# Altium project smoothieboard-alt.PrjPcb (part 2 of 4)

## Sheet smoothieboard-alt-p1.SchDoc: =ProjectTitle
size B; Organization: Altium Limited; Address1: L3, 12a Rodborough Rd; Address2: Frenchs Forest; Address3: NSW; Address4: Australia 2086; DocumentNumber: 2; Revision: 0.1; SheetNumber: 2; SheetTotal: 6
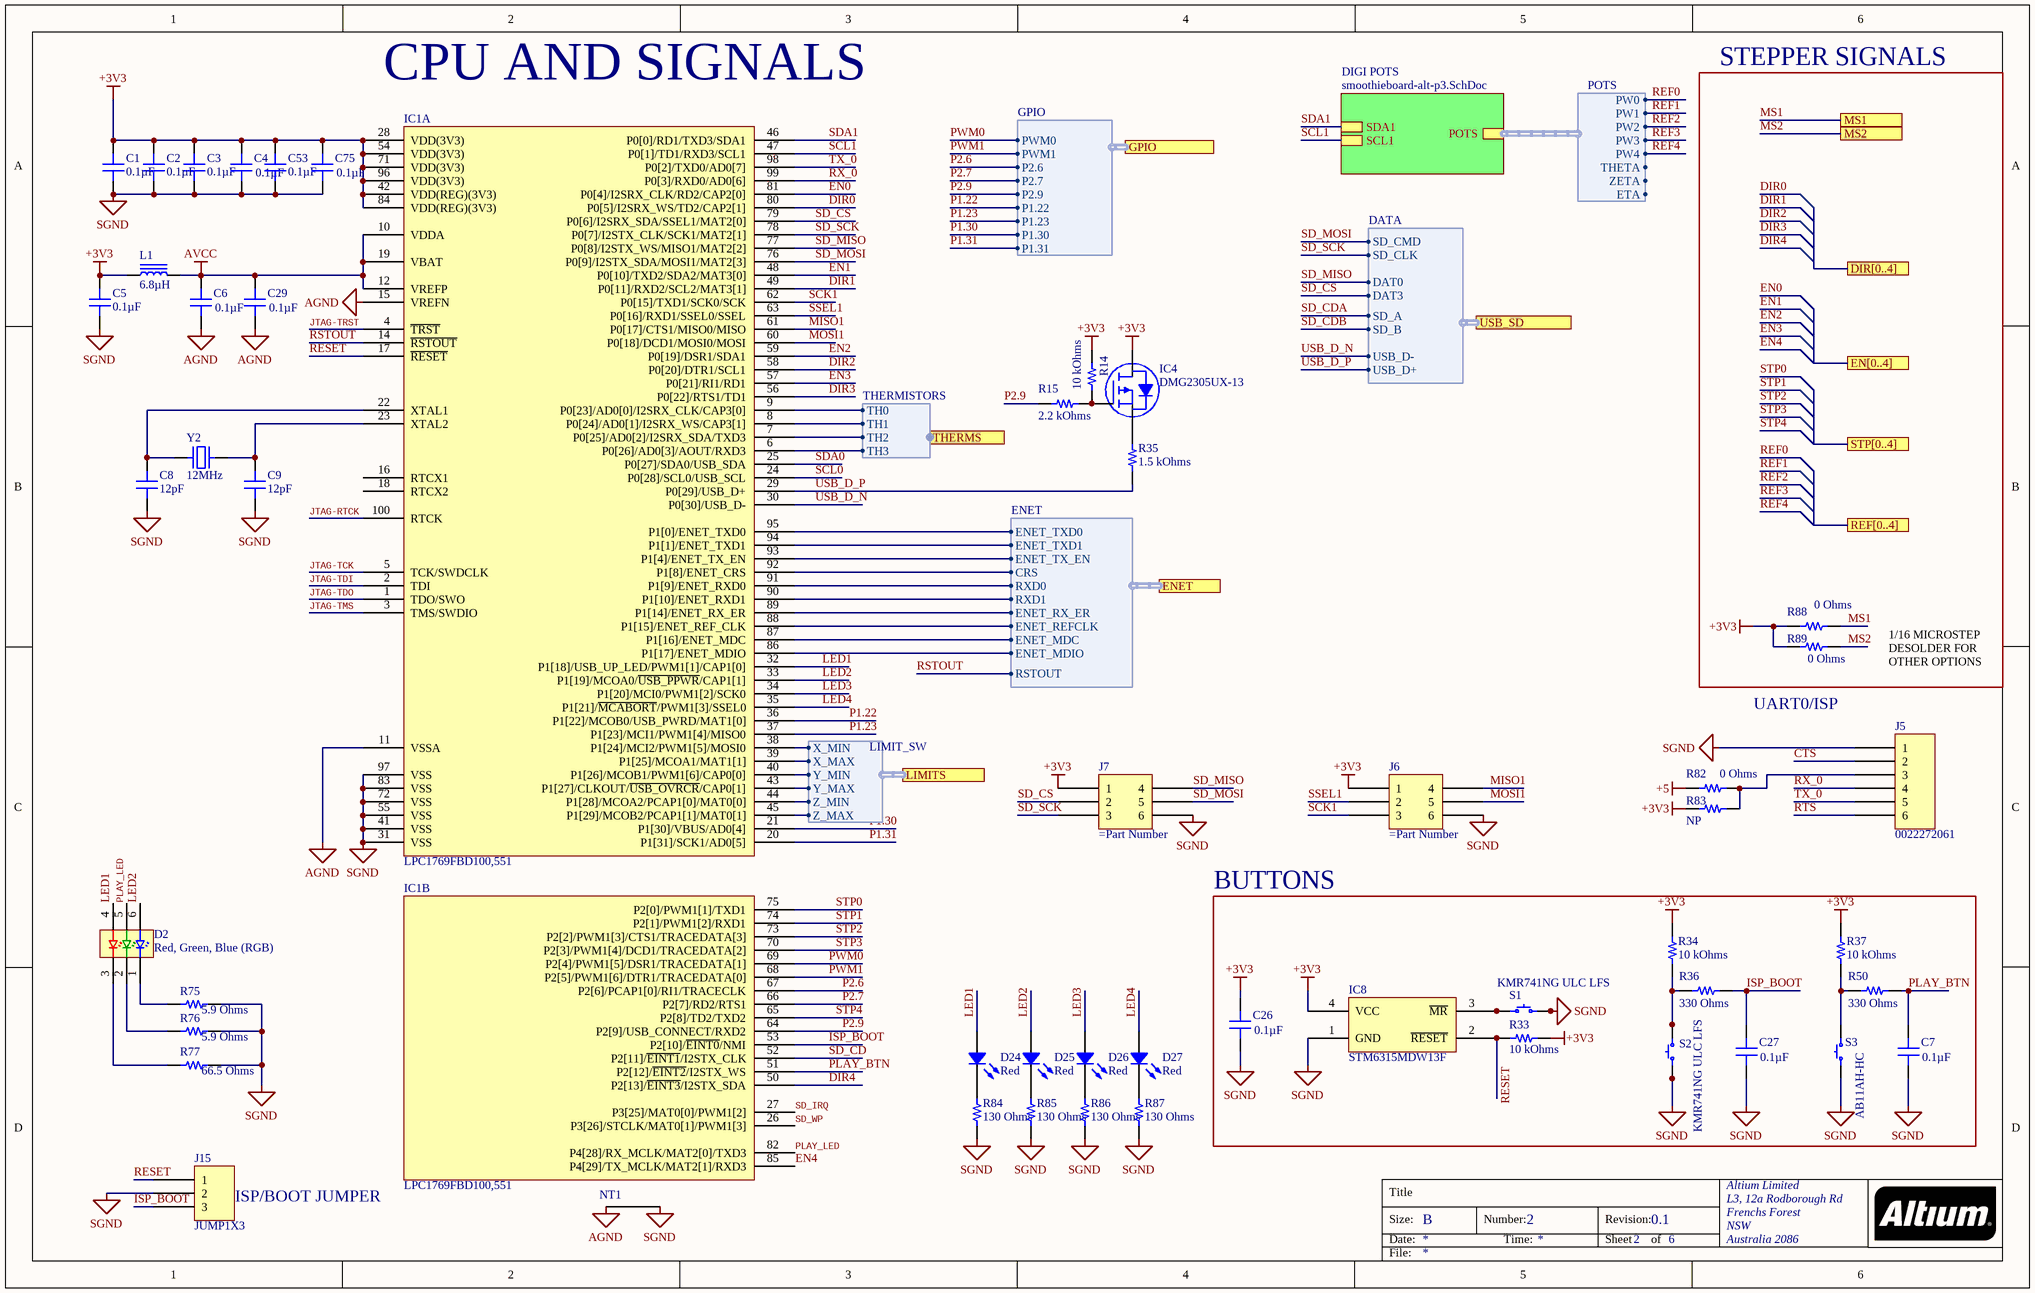
[diagram p1: smoothieboard-alt-p1.SchDoc]

### Parts
C1  0.1µF  [CAP 0402_1005]
C2  0.1µF  [CAP 0402_1005]
C3  0.1µF  [CAP 0402_1005]
C4  0.1µF  [CAP 0402_1005]
C5  0.1µF  [CAP 0402_1005]
C6  0.1µF  [CAP 0402_1005]
C7  0.1µF  [CAP 0402_1005]
C8  12pF  [CAP 0402_1005]
C9  12pF  [CAP 0402_1005]
C26  0.1µF  [CAP 0402_1005]
C27  0.1µF  [CAP 0402_1005]
C29  0.1µF  [CAP 0402_1005]
C53  0.1µF  [CAP 0402_1005]
C75  0.1µF  [CAP 0402_1005]
D2  Red, Green, Blue (RGB)  [LED PLCC6-CREE 5.5X5.3MM]
D24  Red  [LED 0603_1608 RED]
D25  Red  [LED 0603_1608 RED]
D26  Red  [LED 0603_1608 RED]
D27  Red  [LED 0603_1608 RED]
IC1  LPC1769FBD100,551  [NXP LQFP-100 14X14MM]  (parts A,B of 2)
IC4  DMG2305UX-13  [DIODES SOT-23-3]
IC8  STM6315MDW13F  [ST SOT-143-4]
J5  0022272061  [MOLEX KK 0022272061]
J6  (no value)  [PROG_PORT]
J7  (no value)  [PROG_PORT]
J15  JUMP1X3  [JUMP1X3]
L1  6.8µH  [IND 0806_2016]
NT1  NETTIE  [NETTIE]  (value not drawn)  (net tie, no BOM)
R14  10 kOhms  [RES 0603_1608]
R15  2.2 kOhms  [RES 0402_1005]
R33  10 kOhms  [RES 0603_1608]
R34  10 kOhms  [RES 0603_1608]
R35  1.5 kOhms  [RES 0402_1005]
R36  330 Ohms  [RES 0603_1608]
R37  10 kOhms  [RES 0603_1608]
R50  330 Ohms  [RES 0603_1608]
R75  5.9 Ohms  [RES 0402_1005]
R76  5.9 Ohms  [RES 0402_1005]
R77  66.5 Ohms  [RES 0402_1005]
R82  0 Ohms  [RES 0603_1608]
R83  NP  [RES 0603_1608]
R84  130 Ohms  [RES 0402_1005]
R85  130 Ohms  [RES 0402_1005]
R86  130 Ohms  [RES 0402_1005]
R87  130 Ohms  [RES 0402_1005]
R88  0 Ohms  [RES 0603_1608]
R89  0 Ohms  [RES 0603_1608]
S1  KMR741NG ULC LFS  [C&K KMR7]
S2  KMR741NG ULC LFS  [C&K KMR7]
S3  AB11AH-HC  [NKK AB11AH-HC]
Y2  12MHz  [KYOCERA CX3225GB]

### Blocks framed on the sheet
STEPPER SIGNALS: R88 R89
BUTTONS: C7 C26 C27 IC8 R33 R34 R36 R37 R50 S1-S3

### Sub-sheets
DIGI POTS = smoothieboard-alt-p3.SchDoc: SCL1, SDA1, POTS (harness POTS)

### Ports
DIR[0..4], EN[0..4], ENET (harness ENET), GPIO (harness GPIO), LIMITS (harness LIMIT_SW), MS1, MS2, REF[0..4], STP[0..4], THERMS (harness THERMISTORS), USB_SD (harness DATA)

### Harnesses
POTS: ETA, PW0, PW1, PW2, PW3, PW4, THETA, ZETA
LIMIT_SW: X_MIN, X_MAX, Y_MIN, Y_MAX, Z_MIN, Z_MAX
DATA: SD_CMD, SD_CLK, DAT0, DAT3, SD_A, SD_B, USB_D-, USB_D+
GPIO: PWM0, PWM1, P2.6, P2.7, P2.9, P1.22, P1.23, P1.30, P1.31
THERMISTORS: TH0, TH1, TH2, TH3
ENET: CRS, RXD0, RXD1, ENET_TXD0, ENET_TXD1, ENET_TX_EN, ENET_RX_ER, ENET_REFCLK, ENET_MDC, ENET_MDIO, RSTOUT

### Nets
+3V3: C1.2 C2.2 C3.2 C4.2 C5.2 C26.2 C53.2 C75.2 IC1.28(VDD(3V3)) IC1.42(VDD(REG)(3V3)) IC1.54(VDD(3V3)) IC1.71(VDD(3V3)) IC1.84(VDD(REG)(3V3)) IC1.96(VDD(3V3)) IC4.3(D) IC8.4(VCC) J6.1 J7.1 L1.1 R14.1 R33.2 R34.1 R37.1 R83.1 R88.1 R89.1
+5: R82.1
AGND: C6.1 C29.1 IC1.11(VSSA) IC1.15(VREFN) NT1.1
AVCC: C6.2 C29.2 IC1.10(VDDA) IC1.12(VREFP) IC1.19(VBAT) L1.2
SGND: C1.1 C2.1 C3.1 C4.1 C5.1 C7.1 C8.2 C9.2 C26.1 C27.1 C53.1 C75.1 IC1.31(VSS) IC1.41(VSS) IC1.55(VSS) IC1.72(VSS) IC1.83(VSS) IC1.97(VSS) IC8.1(GND) J5.1 J6.6 J7.6 J15.2 NT1.2 R75.1 R76.1 R77.1 R84.1 R85.1 R86.1 R87.1 S1.3 S1.4 S2.1 S2.2 S3.1
CTS: J5.2
DIR0: IC1.80(P0[5]/I2SRX_WS/TD2/CAP2[1])
DIR1: IC1.49(P0[11]/RXD2/SCL2/MAT3[1])
DIR2: IC1.58(P0[20]/DTR1/SCL1)
DIR3: IC1.56(P0[22]/RTS1/TD1)
DIR4: IC1.50(P2[13]/~{EINT3}/I2STX_SDA)
EN0: IC1.81(P0[4]/I2SRX_CLK/RD2/CAP2[0])
EN1: IC1.48(P0[10]/TXD2/SDA2/MAT3[0])
EN2: IC1.59(P0[19]/DSR1/SDA1)
EN3: IC1.57(P0[21]/RI1/RD1)
EN4: IC1.85(P4[29]/TX_MCLK/MAT2[1]/RXD3)
ENET_CRS: IC1.92(P1[8]/ENET_CRS) ; port ENET.CRS
ENET_MDC: IC1.87(P1[16]/ENET_MDC) ; port ENET.ENET_MDC
ENET_MDIO: IC1.86(P1[17]/ENET_MDIO) ; port ENET.ENET_MDIO
ENET_REFCLK: IC1.88(P1[15]/ENET_REF_CLK) ; port ENET.ENET_REFCLK
ENET_RX_ER: IC1.89(P1[14]/ENET_RX_ER) ; port ENET.ENET_RX_ER
ENET_RXD0: IC1.91(P1[9]/ENET_RXD0) ; port ENET.RXD0
ENET_RXD1: IC1.90(P1[10]/ENET_RXD1) ; port ENET.RXD1
ENET_TX_EN: IC1.93(P1[4]/ENET_TX_EN) ; port ENET.ENET_TX_EN
ENET_TXD0: IC1.95(P1[0]/ENET_TXD0) ; port ENET.ENET_TXD0
ENET_TXD1: IC1.94(P1[1]/ENET_TXD1) ; port ENET.ENET_TXD1
ISP_BOOT: C27.2 IC1.53(P2[10]/~{EINT0}/NMI) J15.3 R36.1
JTAG-RTCK: IC1.100(RTCK)
JTAG-TCK: IC1.5(TCK/SWDCLK)
JTAG-TDI: IC1.2(TDI)
JTAG-TDO: IC1.1(TDO/SWO)
JTAG-TMS: IC1.3(TMS/SWDIO)
JTAG-TRST: IC1.4(~{TRST})
LED1: D2.4(A3) D24.1 IC1.32(P1[18]/USB_UP_LED/PWM1[1]/CAP1[0])
LED2: D2.6(A1) D25.1 IC1.33(P1[19]/MCOA0/~{USB_PPWR}/CAP1[1])
LED3: D26.1 IC1.34(P1[20]/MCI0/PWM1[2]/SCK0)
LED4: D27.1 IC1.35(P1[21]/~{MCABORT}/PWM1[3]/SSEL0)
MISO1: IC1.61(P0[17]/CTS1/MISO0/MISO) J6.4
MOSI1: IC1.60(P0[18]/DCD1/MOSI0/MOSI) J6.5
MS1: R88.2 ; port MS1
MS2: R89.2 ; port MS2
P1.22: IC1.36(P1[22]/MCOB0/USB_PWRD/MAT1[0]) ; port GPIO.P1.22
P1.23: IC1.37(P1[23]/MCI1/PWM1[4]/MISO0) ; port GPIO.P1.23
P1.30: IC1.21(P1[30]/VBUS/AD0[4]) ; port GPIO.P1.30
P1.31: IC1.20(P1[31]/SCK1/AD0[5]) ; port GPIO.P1.31
P2.6: IC1.67(P2[6]/PCAP1[0]/RI1/TRACECLK) ; port GPIO.P2.6
P2.7: IC1.66(P2[7]/RD2/RTS1) ; port GPIO.P2.7
P2.9: IC1.64(P2[9]/USB_CONNECT/RXD2) R15.2 ; port GPIO.P2.9
PLAY_BTN: C7.2 IC1.51(P2[12]/~{EINT2}/I2STX_WS) R50.1
PLAY_LED: D2.5(A2) IC1.82(P4[28]/RX_MCLK/MAT2[0]/TXD3)
PWM0: IC1.69(P2[4]/PWM1[5]/DSR1/TRACEDATA[1]) ; port GPIO.PWM0
PWM1: IC1.68(P2[5]/PWM1[6]/DTR1/TRACEDATA[0]) ; port GPIO.PWM1
RESET: IC1.17(~{RESET}) IC8.2(~{RESET}) J15.1 R33.1
RSTOUT: IC1.14(~{RSTOUT}) ; port ENET.RSTOUT
RTS: J5.6
RX_0: IC1.99(P0[3]/RXD0/AD0[6]) J5.4
SCK1: IC1.62(P0[15]/TXD1/SCK0/SCK) J6.3
SCL0: IC1.24(P0[28]/SCL0/USB_SCL)
SCL1: IC1.47(P0[1]/TD1/RXD3/SCL1) ; sheet DIGI POTS/SCL1
SD_CD: IC1.52(P2[11]/~{EINT1}/I2STX_CLK)
SD_CS: IC1.79(P0[6]/I2SRX_SDA/SSEL1/MAT2[0]) J7.2 ; port USB_SD.DAT3
SD_IRQ: IC1.27(P3[25]/MAT0[0]/PWM1[2])
SD_MISO: IC1.77(P0[8]/I2STX_WS/MISO1/MAT2[2]) J7.4 ; port USB_SD.DAT0
SD_MOSI: IC1.76(P0[9]/I2STX_SDA/MOSI1/MAT2[3]) J7.5 ; port USB_SD.SD_CMD
SD_SCK: IC1.78(P0[7]/I2STX_CLK/SCK1/MAT2[1]) J7.3 ; port USB_SD.SD_CLK
SD_WP: IC1.26(P3[26]/STCLK/MAT0[1]/PWM1[3])
SDA0: IC1.25(P0[27]/SDA0/USB_SDA)
SDA1: IC1.46(P0[0]/RD1/TXD3/SDA1) ; sheet DIGI POTS/SDA1
SSEL1: IC1.63(P0[16]/RXD1/SSEL0/SSEL) J6.2
STP0: IC1.75(P2[0]/PWM1[1]/TXD1)
STP1: IC1.74(P2[1]/PWM1[2]/RXD1)
STP2: IC1.73(P2[2]/PWM1[3]/CTS1/TRACEDATA[3])
STP3: IC1.70(P2[3]/PWM1[4]/DCD1/TRACEDATA[2])
STP4: IC1.65(P2[8]/TD2/TXD2)
TH0: IC1.9(P0[23]/AD0[0]/I2SRX_CLK/CAP3[0]) ; port THERMS.TH0
TH1: IC1.8(P0[24]/AD0[1]/I2SRX_WS/CAP3[1]) ; port THERMS.TH1
TH2: IC1.7(P0[25]/AD0[2]/I2SRX_SDA/TXD3) ; port THERMS.TH2
TH3: IC1.6(P0[26]/AD0[3]/AOUT/RXD3) ; port THERMS.TH3
TX_0: IC1.98(P0[2]/TXD0/AD0[7]) J5.5
USB_D_N: IC1.30(P0[30]/USB_D-) ; port USB_SD.USB_D-
USB_D_P: IC1.29(P0[29]/USB_D+) R35.1 ; port USB_SD.USB_D+
NetC8_1: C8.1 IC1.22(XTAL1) Y2.3
NetC9_1: C9.1 IC1.23(XTAL2) Y2.1
NetC20_2: IC1.38(P1[24]/MCI2/PWM1[5]/MOSI0) ; port LIMITS.X_MIN
NetC21_2: IC1.39(P1[25]/MCOA1/MAT1[1]) ; port LIMITS.X_MAX
NetC22_2: IC1.40(P1[26]/MCOB1/PWM1[6]/CAP0[0]) ; port LIMITS.Y_MIN
NetC23_2: IC1.43(P1[27]/CLKOUT/~{USB_OVRCR}/CAP0[1]) ; port LIMITS.Y_MAX
NetC24_2: IC1.44(P1[28]/MCOA2/PCAP1[0]/MAT0[0]) ; port LIMITS.Z_MIN
NetC25_2: IC1.45(P1[29]/MCOB2/PCAP1[1]/MAT0[1]) ; port LIMITS.Z_MAX
NetD2_1: D2.1(C1) R75.2
NetD2_2: D2.2(C2) R76.2
NetD2_3: D2.3(C3) R77.2
NetD24_2: D24.2 R84.2
NetD25_2: D25.2 R85.2
NetD26_2: D26.2 R86.2
NetD27_2: D27.2 R87.2
NetIC4_1: IC4.1(G) R14.2 R15.1
NetIC4_2: IC4.2(S) R35.2
NetIC8_3: IC8.3(~{MR}) S1.1 S1.2
NetJ5_3: J5.3 R82.2 R83.2
NetR34_2: R34.2 R36.2 S2.3 S2.4
NetR37_2: R37.2 R50.2 S3.2

Not connected (* = marked no-connect by the designer): IC1 16(RTCX1) 18(RTCX2)

### Notes on the sheet
- (near IC1) CPU AND SIGNALS
- 1/16 MICROSTEP
  DESOLDER FOR OTHER OPTIONS
- UART0/ISP
- (near J15) ISP/BOOT JUMPER
- Title
- Size:
- Date:
- B
- Number:
- Time:
- Revision:
- Sheet
- of
- File:

### Library data of the parts
C1-C7 C26 C27 C29 C53 C75 = CC0402MRX5R5BB104: CAP CER 0.1UF 6.3V X5R 0402; Manufacturer: Yageo; Tolerance: ±20%; Part Number: CC0402MRX5R5BB104; Value: 0.1µF; Applications: General Purpose; Capacitance: 0.1µF; ComponentLink1Description: Datasheet; ComponentLink1URL: https://www.yageo.com/upload/media/product/productsearch/datasheet/mlcc/UPY-GPHC_X5R_4V-to-50V_25.pdf; ComponentLink2Description: DigiKey Link; ComponentLink2URL: http://digikey.com/product-detail/en/yageo/CC0402MRX5R5BB104/311-3818-1-ND/8024907; Device Package: 0402 (1005 Metric); LastUpdated: 9/2/2020 01:02:24; Lifecycle Status: Active; Minimum Order: 1; Mounting Type: Surface Mount, MLCC; Operating Temperature: -55°C ~ 85°C; Package / Case: 0402 (1005 Metric); Packaging: CutTape; PartId: 1960; Part Status: Active; Price: 0.10; Series: CC; Size / Dimension: 0.039" L x 0.020" W (1.00mm x 0.50mm); Supplier 1: DigiKey; Supplier Part Number 1: 311-3818-1-ND; Temperature Coefficient: X5R; Thickness (Max): 0.022" (0.55mm); Voltage - Rated: 6.3V
C8 C9 = C0402C120J8GAC7867: CAP CER 12PF 10V NP0 0402; Manufacturer: KEMET; Temperature Coefficient: C0G, NP0; Tolerance: ±5%; Part Number: C0402C120J8GAC7867; Value: 12pF; Applications: General Purpose; Capacitance: 12pF; ComponentLink1Description: Datasheet; ComponentLink1URL: https://api.kemet.com/component-edge/download/datasheet/C0402C120J8GACTU.pdf; ComponentLink2Description: DigiKey Link; ComponentLink2URL: http://digikey.com/product-detail/en/kemet/C0402C120J8GAC7867/399-14417-1-ND/7103709; Device Package: 0402 (1005 Metric); Features: Low ESL; LastUpdated: 9/2/2020 01:02:11; Lifecycle Status: Active; Minimum Order: 1; Mounting Type: Surface Mount, MLCC; Operating Temperature: -55°C ~ 125°C; Package / Case: 0402 (1005 Metric); Packaging: TapeAndReel; PartId: 7556; Part Status: Active; Price: 0.07; Series: SMD Comm C0G; Size / Dimension: 0.039" L x 0.020" W (1.00mm x 0.50mm); Supplier 1: DigiKey; Supplier Part Number 1: 399-14417-1-ND; Thickness (Max): 0.022" (0.55mm); Voltage - Rated: 10V
D2 = SLV6A-FKB-CK1P1G1BB7R3R3: LED RGB 6PLCC SMD; Manufacturer: Cree Inc.; Configuration: Independent; Current - Test: 20mA Red, 20mA Green, 20mA Blue; Lens Color: 2.60mm; Lens Size: 4.20mm Dia; Lens Style: Round with Flat Top; Millicandela Rating: 840mcd Red, 1680mcd Green, 420mcd Blue; Voltage - Forward (Vf) (Typ): 2V Red, 3.2V Green, 3.2V Blue; Wavelength - Dominant: 622nm Red, 530nm Green, 470nm Blue; Part Number: SLV6A-FKB-CK1P1G1BB7R3R3; Color: Red, Green, Blue (RGB); ComponentLink1Description: Datasheet; ComponentLink1URL: https://www.cree.com/led-components/media/documents/1320-SLV6A-FKB.pdf; ComponentLink2Description: DigiKey Link; ComponentLink2URL: http://digikey.com/product-detail/en/cree-inc/SLV6A-FKB-CK1P1G1BB7R3R3/SLV6A-FKB-CK1P1G1BB7R3R3CT-ND/6138648; Device Package: 6-SMD, J-Lead; Height (Max): 2.60mm; LastUpdated: 3/19/2020 22:22:30; Lifecycle Status: Active; Minimum Order: 1; Mounting Type: Surface Mount; Package / Case: 6-SMD, J-Lead; Packaging: TapeAndReel; PartId: 954; Part Status: Active; Price: 0.33; Series: SLV6A-FKB; Size / Dimension: 5.50mm L x 5.30mm W; Supplier 1: DigiKey; Supplier Part Number 1: SLV6A-FKB-CK1P1G1BB7R3R3CT-ND; Supplier Device Package: 6-PLCC; Value: Red, Green, Blue (RGB)
D24-D27 = EAST16084RA0: LED RED CLEAR 2SMD; Manufacturer: Everlight Electronics Co Ltd; Configuration: Standard; Current - Test: 20mA; Lens Color: Colorless; Lens Size: 1.00mm x 0.80mm; Lens Style: Rectangle with Flat Top; Millicandela Rating: 79mcd; Viewing Angle: 120°; Voltage - Forward (Vf) (Typ): 2V; Wavelength - Dominant: 624nm; Wavelength - Peak: 632nm; Part Number: EAST16084RA0; Color: Red; ComponentLink1Description: Datasheet; ComponentLink1URL: https://everlightamericas.com/index.php?controller=attachment&id_attachment=918; ComponentLink2Description: DigiKey Link; ComponentLink2URL: http://digikey.com/product-detail/en/everlight-electronics-co-ltd/EAST16084RA0/1080-EAST16084RA0CT-ND/11201073; Device Package: 0603 (1608 Metric); Height (Max): 0.50mm; LastUpdated: 9/2/2020 01:20:55; Lens Transparency: Clear; Lifecycle Status: Active; Minimum Order: 1; Mounting Type: Surface Mount; Package / Case: 0603 (1608 Metric); Packaging: TapeAndReel; PartId: 941; Part Status: Active; Price: 0.06; Series: -; Size / Dimension: 1.60mm L x 0.80mm W; Supplier 1: DigiKey; Supplier Part Number 1: 1080-EAST16084RA0CT-ND; Supplier Device Package: 2-SMD; Value: Red
IC1 = LPC1769FBD100,551: IC MCU 32BIT 512KB FLASH 100LQFP; Manufacturer: NXP USA Inc.; Connectivity: CANbus, Ethernet, I²C, IrDA, Microwire, SPI, SSI, UART/USART, USB OTG; Core Processor: ARM® Cortex®-M3; Core Size: 32-Bit; Data Converters: A/D 8x12b; D/A 1x10b; Number of I/O: 70; Oscillator Type: Internal; Peripherals: Brown-out Detect/Reset, DMA, I²S, Motor Control PWM, POR, PWM, WDT; Program Memory Size: 512KB (512K x 8); RAM Size: 64K x 8; Speed: 120MHz; Voltage - Supply (Vcc/Vdd): 2.4V ~ 3.6V; Part Number: LPC1769FBD100,551; ComponentLink1Description: Datasheet; ComponentLink1URL: https://www.nxp.com/docs/en/data-sheet/LPC1769_68_67_66_65_64_63.pdf; ComponentLink2Description: DigiKey Link; ComponentLink2URL: //digikey.com/product-detail/en/nxp-usa-inc/LPC1769FBD100551/568-4966-ND/2206364; Device Package: 100-LQFP; LastUpdated: 12/3/2019 22:12:33; Lifecycle Status: 0; Minimum Order: 1; Mounting Type: Surface Mount; Operating Temperature: -40°C ~ 85°C (TA); Package / Case: 100-LQFP; Packaging: Tray; PartId: 57; Part Status: Active; Price: 11.75; Program Memory Type: FLASH; Series: LPC17xx; Supplier 1: DigiKey; Supplier Part Number 1: 568-4966-ND; Supplier Device Package: 100-LQFP (14x14)
IC4 = DMG2305UX-13: MOSFET P-CH 20V 4.2A SOT23; Manufacturer: Diodes Incorporated; Current - Continuous Drain (Id) @ 25°C: 4.2A (Ta); Drive Voltage (Max Rds On,  Min Rds On): 1.8V, 4.5V; FET Type: P-Channel; Gate Charge (Qg) (Max) @ Vgs: 10.2nC @ 4.5V; Input Capacitance (Ciss) (Max) @ Vds: 808pF @ 15V; Power Dissipation (Max): 1.4W (Ta); Rds On (Max) @ Id, Vgs: 52mOhm @ 4.2A, 4.5V; Vgs (Max): ±8V; Vgs(th) (Max) @ Id: 900mV @ 250µA; Part Number: DMG2305UX-13; ComponentLink1Description: Datasheet; ComponentLink1URL: https://www.diodes.com/assets/Datasheets/DMG2305UX.pdf; ComponentLink2Description: DigiKey Link; ComponentLink2URL: http://digikey.com/product-detail/en/diodes-incorporated/DMG2305UX-13/DMG2305UX-13DICT-ND/4251589; Drain to Source Voltage (Vdss): 20V; LastUpdated: 9/2/2020 01:25:04; Lifecycle Status: Active; Minimum Order: 1; Mounting Type: Surface Mount; Operating Temperature: -55°C ~ 150°C (TJ); Package / Case: TO-236-3, SC-59, SOT-23-3; Packaging: TapeAndReel; Part Status: Active; Price: 0.05; Series: -; Supplier 1: DigiKey; Supplier Part Number 1: DMG2305UX-13DICT-ND; Supplier Device Package: SOT-23; Technology: MOSFET (Metal Oxide)
IC8 = STM6315MDW13F: IC SUPERVISOR 1 CHANNEL SOT143-4; Manufacturer: STMicroelectronics; Number of Voltages Monitored: 1; Output: Open Drain or Open Collector; Reset: Active Low; Reset Timeout: 140ms Minimum; Voltage - Threshold: 4.38V; Part Number: STM6315MDW13F; ComponentLink1Description: Datasheet; ComponentLink1URL: http://www.st.com/content/ccc/resource/technical/document/datasheet/64/6b/44/43/61/e6/41/d5/CD00081393.pdf/files/CD00081393.pdf/jcr:content/translations/en.CD00081393.pdf; ComponentLink2Description: DigiKey Link; ComponentLink2URL: http://digikey.com/product-detail/en/stmicroelectronics/STM6315MDW13F/497-6028-1-ND/1632057; LastUpdated: 9/2/2020 01:24:56; Lifecycle Status: Active; Minimum Order: 1; Mounting Type: Surface Mount; Operating Temperature: -40°C ~ 125°C (TA); Package / Case: TO-253-4, TO-253AA; Packaging: TapeAndReel; Part Status: Active; Price: 0.23; Series: -; Supplier 1: DigiKey; Supplier Part Number 1: 497-6028-1-ND; Supplier Device Package: SOT-143-4; Type: Simple Reset/Power-On Reset
J5 = 0022272061: CONN HEADER VERT 6POS 2.54MM; Manufacturer: Molex; Contact Length - Mating: 0.295" (7.49mm); Contact Length - Post: 0.140" (3.56mm); Material Flammability Rating: UL94 V-0; Number of Positions: 6; Number of Positions Loaded: All; Overall Contact Length: 0.560" (14.22mm); Pitch - Mating: 0.100" (2.54mm); Shrouding: Shrouded - 1 Wall; Style: Board to Cable/Wire; Part Number: 0022272061; ComponentLink1Description: Datasheet; ComponentLink1URL: https://www.molex.com/pdm_docs/sd/022272061_sd.pdf; ComponentLink2Description: DigiKey Link; ComponentLink2URL: http://digikey.com/product-detail/en/molex/0022272061/WM4115-ND/1130581; Connector Type: Header; Contact Finish - Mating: Tin; Contact Finish - Post: Tin; Contact Finish Thickness - Mating: 100.0µin (2.54µm); Contact Material: Brass; Contact Shape: Square; Contact Type: Male Pin; Fastening Type: Friction Lock; Insulation Color: Natural; Insulation Height: 0.461" (11.70mm); Insulation Material: Polyamide (PA), Nylon; LastUpdated: 1/12/2020 23:52:24; Lifecycle Status: Active; Minimum Order: 1; Mounting Type: Through Hole; Number of Rows: 1; Packaging: Bulk; PartId: 80; Part Status: Active; Price: 0.49; Series: KK 6410; Supplier 1: DigiKey; Supplier Part Number 1: WM4115-ND; Termination: Solder
J6 J7 = PROG_PORT: 2x3 programming port
L1 = VLS201612HBX-6R8M-1: FIXED IND 6.8UH 910MA 468 MOHM; Manufacturer: TDK Corporation; Current - Saturation: 870mA; DC Resistance (DCR): 468mOhm Max; Inductance Frequency - Test: 1MHz; Material - Core: Metal; Shielding: Shielded; Tolerance: ±20%; Type: Wirewound; Part Number: VLS201612HBX-6R8M-1; ComponentLink1Description: Datasheet; ComponentLink1URL: https://product.tdk.com/info/en/catalog/datasheets/inductor_commercial_power_vls201612hbx-1_en.pdf?ref_disty=digikey; ComponentLink2Description: DigiKey Link; ComponentLink2URL: http://digikey.com/product-detail/en/tdk-corporation/VLS201612HBX-6R8M-1/445-173015-1-ND/5250934; Current Rating (Amps): 910mA; Device Package: 0806 (2016 Metric); Height - Seated (Max): 0.047" (1.20mm); Inductance: 6.8µH; LastUpdated: 9/2/2020 01:24:37; Lifecycle Status: Active; Minimum Order: 1; Mounting Type: Surface Mount; Operating Temperature: -40°C ~ 105°C; Package / Case: 0806 (2016 Metric); Packaging: TapeAndReel; PartId: 223; Part Status: Active; Price: 0.13; Series: VLS-HBX-1; Size / Dimension: 0.079" L x 0.063" W (2.00mm x 1.60mm); Supplier 1: DigiKey; Supplier Part Number 1: 445-173015-1-ND; Supplier Device Package: 0806 (2016 Metric); Value: 6.8µH
NT1 = NETTIE: Net tie point.
R14 R33 R34 R37 = RCS060310K0JNEA: RES SMD 10K OHM 5% 1/4W 0603; Manufacturer: Vishay Dale; Power (Watts): 0.25W, 1/4W; Temperature Coefficient: ±200ppm/°C; Part Number: RCS060310K0JNEA; Value: 10 kOhms; ComponentLink1Description: Datasheet; ComponentLink1URL: http://www.vishay.com/docs/20065/rcse3.pdf; ComponentLink2Description: DigiKey Link; ComponentLink2URL: http://digikey.com/product-detail/en/vishay-dale/RCS060310K0JNEA/541-2817-1-ND/5867110; Composition: Thick Film; Device Package: 0603 (1608 Metric); Features: Automotive AEC-Q200, Pulse Withstanding; Height - Seated (Max): 0.020" (0.50mm); LastUpdated: 9/2/2020 01:10:24; Lifecycle Status: Active; Minimum Order: 1; Number of Terminations: 2; Operating Temperature: -55°C ~ 155°C; Package / Case: 0603 (1608 Metric); Packaging: TapeAndReel; PartId: 5383; Part Status: Active; Price: 0.02; Ratings: AEC-Q200; Resistance: 10 kOhms; Series: RCS e3; Size / Dimension: 0.061" L x 0.033" W (1.55mm x 0.85mm); Supplier 1: DigiKey; Supplier Part Number 1: 541-2817-1-ND; Supplier Device Package: 0603; Tolerance: ±5%
R15 = SR0402FR-7T2K2L: RES SMD 0402 1/5W 1% 2.2K OHM; Manufacturer: Yageo; Power (Watts): 0.2W, 1/5W; Temperature Coefficient: ±200ppm/°C; Part Number: SR0402FR-7T2K2L; Value: 2.2 kOhms; ComponentLink1Description: Datasheet; ComponentLink1URL: http://www.yageo.com/documents/recent/PYu-SR_D_F%20tol_RoHS_L_4.pdf; ComponentLink2Description: DigiKey Link; ComponentLink2URL: http://digikey.com/product-detail/en/yageo/SR0402FR-7T2K2L/YAG5818CT-ND/9373203; Composition: Thick Film; Device Package: 0402 (1005 Metric); Features: Automotive AEC-Q200, Pulse Withstanding; Height - Seated (Max): 0.016" (0.40mm); LastUpdated: 9/2/2020 01:08:07; Lifecycle Status: Active; Minimum Order: 1; Number of Terminations: 2; Operating Temperature: -55°C ~ 155°C; Package / Case: 0402 (1005 Metric); Packaging: TapeAndReel; PartId: 4414; Part Status: Active; Price: 0.11; Ratings: AEC-Q200; Resistance: 2.2 kOhms; Series: SR; Size / Dimension: 0.039" L x 0.020" W (1.00mm x 0.50mm); Supplier 1: DigiKey; Supplier Part Number 1: YAG5818CT-ND; Supplier Device Package: 0402; Tolerance: ±1%
R35 = CRCW04021K50FKEDHP: RES SMD 1.5K OHM 1% 1/5W 0402; Manufacturer: Vishay Dale; Power (Watts): 0.2W, 1/5W; Temperature Coefficient: ±100ppm/°C; Part Number: CRCW04021K50FKEDHP; Value: 1.5 kOhms; ComponentLink1Description: Datasheet; ComponentLink1URL: http://www.vishay.com/docs/20043/crcwhpe3.pdf; ComponentLink2Description: DigiKey Link; ComponentLink2URL: http://digikey.com/product-detail/en/vishay-dale/CRCW04021K50FKEDHP/541-1.50KYCT-ND/2223032; Composition: Thick Film; Device Package: 0402 (1005 Metric); Features: Automotive AEC-Q200, Pulse Withstanding; Height - Seated (Max): 0.016" (0.40mm); LastUpdated: 9/2/2020 01:07:48; Lifecycle Status: Active; Minimum Order: 1; Number of Terminations: 2; Operating Temperature: -55°C ~ 155°C; Package / Case: 0402 (1005 Metric); Packaging: TapeAndReel; PartId: 12783; Part Status: Active; Price: 0.01; Ratings: AEC-Q200; Resistance: 1.5 kOhms; Series: CRCW-HP; Size / Dimension: 0.039" L x 0.020" W (1.00mm x 0.50mm); Supplier 1: DigiKey; Supplier Part Number 1: 541-1.50KYCT-ND; Supplier Device Package: 0402; Tolerance: ±1%
R36 R50 = ERJ-3GEYJ331V: RES SMD 330 OHM 5% 1/10W 0603; Manufacturer: Panasonic Electronic Components; Power (Watts): 0.1W, 1/10W; Temperature Coefficient: ±200ppm/°C; Part Number: ERJ-3GEYJ331V; Value: 330 Ohms; ComponentLink1Description: Datasheet; ComponentLink1URL: http://industrial.panasonic.com/www-cgi/jvcr13pz.cgi?E+PZ+3+AOA0001+ERJ3GEYJ331V+7+WW; ComponentLink2Description: DigiKey Link; ComponentLink2URL: http://digikey.com/product-detail/en/panasonic-electronic-components/ERJ-3GEYJ331V/P330GCT-ND/134778; Composition: Thick Film; Device Package: 0603 (1608 Metric); Features: Automotive AEC-Q200; Height - Seated (Max): 0.022" (0.55mm); LastUpdated: 9/2/2020 01:10:18; Lifecycle Status: Active; Minimum Order: 1; Number of Terminations: 2; Operating Temperature: -55°C ~ 155°C; Package / Case: 0603 (1608 Metric); Packaging: TapeAndReel; PartId: 8114; Part Status: Active; Price: 0.01; Ratings: AEC-Q200; Resistance: 330 Ohms; Series: ERJ; Size / Dimension: 0.063" L x 0.031" W (1.60mm x 0.80mm); Supplier 1: DigiKey; Supplier Part Number 1: P330GCT-ND; Supplier Device Package: 0603; Tolerance: ±5%
R75 R76 = CRCW04025R90FKED: RES SMD 5.9 OHM 1% 1/16W 0402; Manufacturer: Vishay Dale; Power (Watts): 0.063W, 1/16W; Temperature Coefficient: ±100ppm/°C; Part Number: CRCW04025R90FKED; Value: 5.9 Ohms; ComponentLink1Description: Datasheet; ComponentLink1URL: http://www.vishay.com/docs/20035/dcrcwe3.pdf; ComponentLink2Description: DigiKey Link; ComponentLink2URL: http://digikey.com/product-detail/en/vishay-dale/CRCW04025R90FKED/541-5.90LLCT-ND/1961971; Composition: Thick Film; Device Package: 0402 (1005 Metric); Features: Automotive AEC-Q200; Height - Seated (Max): 0.016" (0.40mm); LastUpdated: 9/2/2020 01:07:48; Lifecycle Status: Active; Minimum Order: 1; Number of Terminations: 2; Operating Temperature: -55°C ~ 155°C; Package / Case: 0402 (1005 Metric); Packaging: CutTape; PartId: 12971; Part Status: Active; Price: 0.10; Ratings: AEC-Q200; Resistance: 5.9 Ohms; Series: CRCW; Size / Dimension: 0.039" L x 0.020" W (1.00mm x 0.50mm); Supplier 1: DigiKey; Supplier Part Number 1: 541-5.90LLCT-ND; Supplier Device Package: 0402; Tolerance: ±1%
R77 = ERJ-2RKF66R5X: RES SMD 66.5 OHM 1% 1/10W 0402; Manufacturer: Panasonic Electronic Components; Power (Watts): 0.1W, 1/10W; Temperature Coefficient: ±100ppm/°C; Part Number: ERJ-2RKF66R5X; Value: 66.5 Ohms; ComponentLink1Description: Datasheet; ComponentLink1URL: https://industrial.panasonic.com/cdbs/www-data/pdf/RDA0000/AOA0000C304.pdf; ComponentLink2Description: DigiKey Link; ComponentLink2URL: http://digikey.com/product-detail/en/panasonic-electronic-components/ERJ-2RKF66R5X/P66.5LCT-ND/194488; Composition: Thick Film; Device Package: 0402 (1005 Metric); Features: Automotive AEC-Q200; Height - Seated (Max): 0.016" (0.40mm); LastUpdated: 9/2/2020 01:08:01; Lifecycle Status: Active; Minimum Order: 1; Number of Terminations: 2; Operating Temperature: -55°C ~ 155°C; Package / Case: 0402 (1005 Metric); Packaging: CutTape; PartId: 6560; Part Status: Active; Price: 0.10; Ratings: AEC-Q200; Resistance: 66.5 Ohms; Series: ERJ; Size / Dimension: 0.039" L x 0.020" W (1.00mm x 0.50mm); Supplier 1: DigiKey; Supplier Part Number 1: P66.5LCT-ND; Supplier Device Package: 0402; Tolerance: ±1%
R82 R88 R89 = CRCW06030000Z0EAHP: RES SMD 0 OHM JUMPER 1/4W 0603; Manufacturer: Vishay Dale; Power (Watts): 0.25W, 1/4W; Part Number: CRCW06030000Z0EAHP; Value: 0 Ohms; ComponentLink1Description: Datasheet; ComponentLink1URL: http://www.vishay.com/docs/20043/crcwhpe3.pdf; ComponentLink2Description: DigiKey Link; ComponentLink2URL: http://digikey.com/product-detail/en/vishay-dale/CRCW06030000Z0EAHP/541-0.0SBCT-ND/2222749; Composition: Thick Film; Device Package: 0603 (1608 Metric); Features: Automotive AEC-Q200, Pulse Withstanding; Height - Seated (Max): 0.022" (0.55mm); LastUpdated: 9/2/2020 01:10:23; Lifecycle Status: Active; Minimum Order: 1; Number of Terminations: 2; Operating Temperature: -55°C ~ 155°C; Package / Case: 0603 (1608 Metric); Packaging: TapeAndReel; PartId: 5474; Part Status: Active; Price: 0.02; Ratings: AEC-Q200; Resistance: 0 Ohms; Series: CRCW-HP; Size / Dimension: 0.063" L x 0.033" W (1.60mm x 0.85mm); Supplier 1: DigiKey; Supplier Part Number 1: 541-0.0SBCT-ND; Supplier Device Package: 0603; Tolerance: Jumper
R83 = CRCW06030000Z0EAHP: RES SMD 0 OHM JUMPER 1/4W 0603; Manufacturer: Vishay Dale; Power (Watts): 0.25W, 1/4W; Resistance: 0 Ohms; Part Number: CRCW06030000Z0EAHP; Value: NP; ComponentLink1Description: Datasheet; ComponentLink1URL: http://www.vishay.com/docs/20043/crcwhpe3.pdf; ComponentLink2Description: DigiKey Link; ComponentLink2URL: http://digikey.com/product-detail/en/vishay-dale/CRCW06030000Z0EAHP/541-0.0SBCT-ND/2222749; Composition: Thick Film; Device Package: 0603 (1608 Metric); Features: Automotive AEC-Q200, Pulse Withstanding; Height - Seated (Max): 0.022" (0.55mm); LastUpdated: 9/2/2020 01:10:23; Lifecycle Status: Active; Minimum Order: 1; Number of Terminations: 2; Operating Temperature: -55°C ~ 155°C; Package / Case: 0603 (1608 Metric); Packaging: TapeAndReel; PartId: 5474; Part Status: Active; Price: 0.02; Ratings: AEC-Q200; Series: CRCW-HP; Size / Dimension: 0.063" L x 0.033" W (1.60mm x 0.85mm); Supplier 1: DigiKey; Supplier Part Number 1: 541-0.0SBCT-ND; Supplier Device Package: 0603; Tolerance: Jumper
R84-R87 = ERJ-PA2J131X: RES SMD 130 OHM 5% 1/5W 0402; Manufacturer: Panasonic Electronic Components; Power (Watts): 0.2W, 1/5W; Temperature Coefficient: ±200ppm/°C; Part Number: ERJ-PA2J131X; Value: 130 Ohms; ComponentLink1Description: Datasheet; ComponentLink1URL: https://industrial.panasonic.com/cdbs/www-data/pdf/RDO0000/AOA0000C331.pdf; ComponentLink2Description: DigiKey Link; ComponentLink2URL: http://digikey.com/product-detail/en/panasonic-electronic-components/ERJ-PA2J131X/P124528CT-ND/10284798; Composition: Thick Film; Device Package: 0402 (1005 Metric); Features: Automotive AEC-Q200, Pulse Withstanding; LastUpdated: 9/2/2020 01:07:33; Lifecycle Status: Active; Minimum Order: 1; Number of Terminations: 2; Operating Temperature: -55°C ~ 155°C; Package / Case: 0402 (1005 Metric); Packaging: TapeAndReel; PartId: 18886; Price: 0.01; Ratings: AEC-Q200; Resistance: 130 Ohms; Series: ERJ; Supplier 1: DigiKey; Supplier Part Number 1: P124528CT-ND; Supplier Device Package: 0402; Tolerance: ±5%; Height - Seated (Max): 0.016" (0.40mm); Part Status: Active; Size / Dimension: 0.039" L x 0.022" W (1.00mm x 0.55mm)
S1 S2 = KMR741NG ULC LFS: SWITCH TACTILE SPST-NO 50MA 32V; Manufacturer: C&K; Actuator Height off PCB, Vertical: 2.50mm; Actuator Orientation: Top Actuated; Actuator Type: Standard; Contact Rating @ Voltage: 0.05A @ 32VDC; Illumination: Non-Illuminated; Ingress Protection: IP67 - Dust Tight, Waterproof; Operating Force: 400gf; Outline: 4.20mm x 2.80mm; Switch Function: Off-Mom; Part Number: KMR741NG ULC LFS; Circuit: SPST-NO; ComponentLink1Description: Datasheet; ComponentLink1URL: https://dznh3ojzb2azq.cloudfront.net/products/Tactile/KMR7/documents/datasheet.pdf; ComponentLink2Description: DigiKey Link; ComponentLink2URL: http://digikey.com/product-detail/en/c-k/KMR741NG-ULC-LFS/CKN10688CT-ND/6035360; LastUpdated: 4/9/2020 10:01:05; Lifecycle Status: Active; Minimum Order: 1; Mounting Type: Surface Mount; Operating Temperature: -40°C ~ 85°C; Packaging: TapeAndReel; Part Status: Active; Price: 0.16; Series: KMR7; Supplier 1: DigiKey; Supplier Part Number 1: CKN10688CT-ND; Termination Style: Gull Wing
S3 = AB11AH-HC: SWITCH PUSH SPST-NO 0.4VA 28V; Manufacturer: NKK Switches; Actuator Type: Round, Button; Color - Actuator/Cap: Red; Current Rating (Amps): 0.4VA (AC/DC); Switch Function: Off-Mom; Part Number: AB11AH-HC; Circuit: SPST-NO; ComponentLink1Description: Datasheet; ComponentLink1URL: https://www.nkkswitches.com/pdf/Apushbuttons.pdf; ComponentLink2Description: DigiKey Link; ComponentLink2URL: http://digikey.com/product-detail/en/nkk-switches/AB11AH-HC/360-2604-ND/1056046; Features: Sealed - Fully; LastUpdated: 1/25/2020 20:05:42; Lifecycle Status: Active; Minimum Order: 1; Mounting Type: Through Hole, Right Angle; Operating Temperature: -30°C ~ 85°C; Packaging: Tray; Part Status: Active; Price: 5.00; Series: AB; Supplier 1: DigiKey; Supplier Part Number 1: 360-2604-ND; Termination Style: PC Pin; Type: Standard; Voltage Rating - AC: 28V; Voltage Rating - DC: 28V
Y2 = CX3225GB12000H0KPSC1: CRYSTAL 12.0000MHZ 12PF SMD; Manufacturer: Kyocera International Inc. Electronic Components; ESR (Equivalent Series Resistance): 150 Ohms; Frequency Stability: ±50ppm; Frequency Tolerance: ±30ppm; Operating Mode: Fundamental; Part Number: CX3225GB12000H0KPSC1; ComponentLink1Description: Datasheet; ComponentLink1URL: //media.digikey.com/pdf/Data%20Sheets/AVX%20PDFs/CX3225GB12000H0KPSC1_Spec.pdf; ComponentLink2Description: DigiKey Link; ComponentLink2URL: http://digikey.com/product-detail/en/kyocera-international-inc-electronic-components/CX3225GB12000H0KPSC1/1253-1596-1-ND/5765377; Frequency: 12MHz; Height - Seated (Max): 0.035" (0.90mm); LastUpdated: 9/2/2020 01:21:57; Lifecycle Status: Active; Load Capacitance: 12pF; Minimum Order: 1; Mounting Type: Surface Mount; Operating Temperature: -40°C ~ 85°C; Package / Case: 4-SMD, No Lead; Packaging: TapeAndReel; PartId: 503; Part Status: Active; Price: 0.32; Series: CX3225GB, Kyocera; Size / Dimension: 0.126" L x 0.098" W (3.20mm x 2.50mm); Supplier 1: DigiKey; Supplier Part Number 1: 1253-1596-1-ND; Type: MHz Crystal; Value: 12MHz

## Sheet smoothieboard-alt-p3.SchDoc: =ProjectTitle
size B; Organization: Altium Limited; Address1: L3, 12a Rodborough Rd; Address2: Frenchs Forest; Address3: NSW; Address4: Australia 2086; DocumentNumber: 4; SheetNumber: 4; SheetTotal: 6
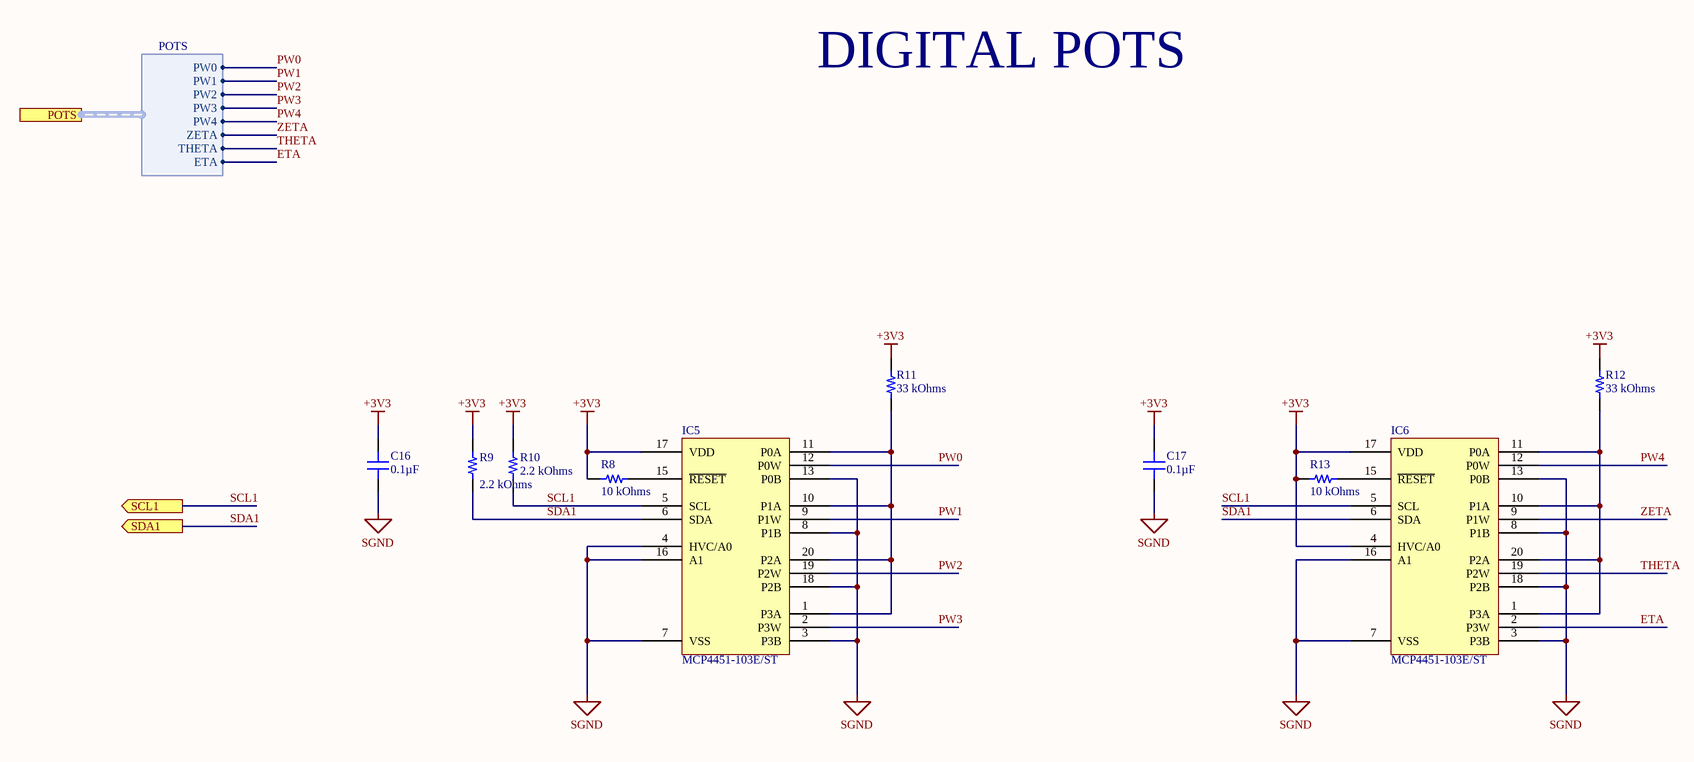
[diagram p2: smoothieboard-alt-p3.SchDoc]

### Parts
C16  0.1µF  [CAP 0402_1005]
C17  0.1µF  [CAP 0402_1005]
IC5  MCP4451-103E/ST  [MICROCHIP TSSOP-20 4.4MM BODY]
IC6  MCP4451-103E/ST  [MICROCHIP TSSOP-20 4.4MM BODY]
R8  10 kOhms  [RES 0402_1005]
R9  2.2 kOhms  [RES 0402_1005]
R10  2.2 kOhms  [RES 0402_1005]
R11  33 kOhms  [RES 0402_1005]
R12  33 kOhms  [RES 0402_1005]
R13  10 kOhms  [RES 0402_1005]

### Ports
POTS (harness POTS), SCL1 (out), SDA1 (out)

### Harnesses
POTS: PW0, PW1, PW2, PW3, PW4, ZETA, THETA, ETA

### Nets
+3V3: C16.2 C17.2 IC5.17(VDD) IC6.4(HVC/A0) IC6.17(VDD) R8.2 R9.2 R10.2 R11.2 R12.2 R13.2
SGND: C16.1 C17.1 IC5.3(P3B) IC5.4(HVC/A0) IC5.7(VSS) IC5.8(P1B) IC5.13(P0B) IC5.16(A1) IC5.18(P2B) IC6.3(P3B) IC6.7(VSS) IC6.8(P1B) IC6.13(P0B) IC6.16(A1) IC6.18(P2B)
ETA: IC6.2(P3W) ; port POTS.ETA
PW0: IC5.12(P0W) ; port POTS.PW0
PW1: IC5.9(P1W) ; port POTS.PW1
PW2: IC5.19(P2W) ; port POTS.PW2
PW3: IC5.2(P3W) ; port POTS.PW3
PW4: IC6.12(P0W) ; port POTS.PW4
SCL1: IC5.5(SCL) IC6.5(SCL) R10.1 ; port SCL1
SDA1: IC5.6(SDA) IC6.6(SDA) R9.1 ; port SDA1
THETA: IC6.19(P2W) ; port POTS.THETA
ZETA: IC6.9(P1W) ; port POTS.ZETA
NetIC5_1: IC5.1(P3A) IC5.10(P1A) IC5.11(P0A) IC5.20(P2A) R11.1
NetIC5_15: IC5.15(~{RESET}) R8.1
NetIC6_1: IC6.1(P3A) IC6.10(P1A) IC6.11(P0A) IC6.20(P2A) R12.1
NetIC6_15: IC6.15(~{RESET}) R13.1

### Notes on the sheet
- DIGITAL POTS
- Title
- Size:
- Date:
- B
- Number:
- Time:
- Revision:
- Sheet
- of
- File:

### Library data of the parts
C16 C17 = CC0402MRX5R5BB104: as C1 on sheet smoothieboard-alt-p1; Part Number: CC0402MRX5R5BB104; Value: 0.1µF; Applications: General Purpose; Capacitance: 0.1µF; ComponentLink1Description: Datasheet; ComponentLink1URL: https://www.yageo.com/upload/media/product/productsearch/datasheet/mlcc/UPY-GPHC_X5R_4V-to-50V_25.pdf; ComponentLink2Description: DigiKey Link; ComponentLink2URL: http://digikey.com/product-detail/en/yageo/CC0402MRX5R5BB104/311-3818-1-ND/8024907; Device Package: 0402 (1005 Metric); LastUpdated: 9/2/2020 01:02:24; Lifecycle Status: Active; Minimum Order: 1; Mounting Type: Surface Mount, MLCC; Operating Temperature: -55°C ~ 85°C; Package / Case: 0402 (1005 Metric); Packaging: CutTape; PartId: 1960; Part Status: Active; Price: 0.10; Series: CC; Size / Dimension: 0.039" L x 0.020" W (1.00mm x 0.50mm); Supplier 1: DigiKey; Supplier Part Number 1: 311-3818-1-ND; Temperature Coefficient: X5R; Thickness (Max): 0.022" (0.55mm); Voltage - Rated: 6.3V
IC5 IC6 = MCP4451-103E/ST: IC DGT POT 10KOHM 257TAP 20TSSOP; Manufacturer: Microchip Technology; Configuration: Potentiometer; Interface: I²C; Memory Type: Volatile; Number of Circuits: 4; Number of Taps: 257; Resistance (Ohms): 10k; Resistance - Wiper (Ohms) (Typ): 75; Temperature Coefficient (Typ): 150ppm/°C; Tolerance: ±20%; Voltage - Supply: 1.8V ~ 5.5V; Part Number: MCP4451-103E/ST; ComponentLink1Description: Datasheet; ComponentLink1URL: http://www.microchip.com/mymicrochip/filehandler.aspx?ddocname=en551978; ComponentLink2Description: DigiKey Link; ComponentLink2URL: //digikey.com/product-detail/en/microchip-technology/MCP4451-103E-ST/MCP4451-103E-ST-ND/2601449; Device Package: 20-TSSOP (0.173", 4.40mm Width); Features: Mute, Selectable Address; LastUpdated: 12/4/2019 00:36:58; Lifecycle Status: 0; Minimum Order: 1; Operating Temperature: -40°C ~ 125°C; Package / Case: 20-TSSOP (0.173", 4.40mm Width); Packaging: Tube; PartId: 1; Part Status: Active; Price: 1.35; Series: -; Supplier 1: DigiKey; Supplier Part Number 1: MCP4451-103E/ST-ND; Supplier Device Package: 20-TSSOP; Taper: Linear
R8 R13 = CRCW040210K0JNTD: RES SMD 10K OHM 5% 1/16W 0402; Manufacturer: Vishay Dale; Power (Watts): 0.063W, 1/16W; Temperature Coefficient: ±200ppm/°C; Part Number: CRCW040210K0JNTD; Value: 10 kOhms; ComponentLink1Description: Datasheet; ComponentLink1URL: http://www.vishay.com/docs/20008/dcrcw.pdf; ComponentLink2Description: DigiKey Link; ComponentLink2URL: http://digikey.com/product-detail/en/vishay-dale/CRCW040210K0JNTD/541-CRCW040210K0JNTDCT-ND/11501263; Composition: Thick Film; Device Package: 0402 (1005 Metric); Features: Automotive AEC-Q200; LastUpdated: 9/2/2020 01:07:22; Lifecycle Status: Active; Minimum Order: 1; Number of Terminations: 2; Operating Temperature: -55°C ~ 155°C; Package / Case: 0402 (1005 Metric); Packaging: TapeAndReel; PartId: 56880; Price: 0.01; Ratings: AEC-Q200; Resistance: 10 kOhms; Series: CRCW; Supplier 1: DigiKey; Supplier Part Number 1: 541-CRCW040210K0JNTDCT-ND; Supplier Device Package: 0402; Tolerance: ±5%
R9 R10 = SR0402FR-7T2K2L: as R15 on sheet smoothieboard-alt-p1; Part Number: SR0402FR-7T2K2L; Value: 2.2 kOhms; ComponentLink1Description: Datasheet; ComponentLink1URL: http://www.yageo.com/documents/recent/PYu-SR_D_F%20tol_RoHS_L_4.pdf; ComponentLink2Description: DigiKey Link; ComponentLink2URL: http://digikey.com/product-detail/en/yageo/SR0402FR-7T2K2L/YAG5818CT-ND/9373203; Composition: Thick Film; Device Package: 0402 (1005 Metric); Features: Automotive AEC-Q200, Pulse Withstanding; Height - Seated (Max): 0.016" (0.40mm); LastUpdated: 9/2/2020 01:08:07; Lifecycle Status: Active; Minimum Order: 1; Number of Terminations: 2; Operating Temperature: -55°C ~ 155°C; Package / Case: 0402 (1005 Metric); Packaging: TapeAndReel; PartId: 4414; Part Status: Active; Price: 0.11; Ratings: AEC-Q200; Resistance: 2.2 kOhms; Series: SR; Size / Dimension: 0.039" L x 0.020" W (1.00mm x 0.50mm); Supplier 1: DigiKey; Supplier Part Number 1: YAG5818CT-ND; Supplier Device Package: 0402; Tolerance: ±1%
R11 R12 = RT0402FRE0733KL: RES SMD 33K OHM 1% 1/16W 0402; Manufacturer: Yageo; Power (Watts): 0.063W, 1/16W; Temperature Coefficient: ±50ppm/°C; Part Number: RT0402FRE0733KL; Value: 33 kOhms; ComponentLink1Description: Datasheet; ComponentLink1URL: https://www.yageo.com/upload/media/product/productsearch/datasheet/rchip/PYu-RT_1-to-0.01_RoHS_L_11.pdf; ComponentLink2Description: DigiKey Link; ComponentLink2URL: http://digikey.com/product-detail/en/yageo/RT0402FRE0733KL/YAG5933CT-ND/9370963; Composition: Thin Film; Device Package: 0402 (1005 Metric); Height - Seated (Max): 0.014" (0.35mm); LastUpdated: 9/2/2020 01:07:32; Lifecycle Status: Active; Minimum Order: 1; Number of Terminations: 2; Operating Temperature: -55°C ~ 155°C; Package / Case: 0402 (1005 Metric); Packaging: TapeAndReel; PartId: 19353; Part Status: Active; Price: 0.01; Resistance: 33 kOhms; Series: RT; Size / Dimension: 0.039" L x 0.020" W (1.00mm x 0.50mm); Supplier 1: DigiKey; Supplier Part Number 1: YAG5933CT-ND; Supplier Device Package: 0402; Tolerance: ±1%